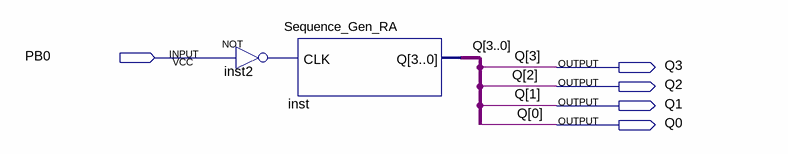
[diagram p0: schematic sheet]
// Quartus schematic main_VHDL.bdf as structural Verilog: 2 symbols, 5 pins
module main_VHDL (
  input  PB0,
  output Q3,
  output Q2,
  output Q1,
  output Q0
);

  wire inst2_out;

  not inst2 (inst2_out, PB0);
  Sequence_Gen_RA inst (.CLK(inst2_out), .Q({Q3, Q2, Q1, Q0}));
endmodule
